# EAGLE design ATtiny10_v2 (EAGLE 8.3.0)
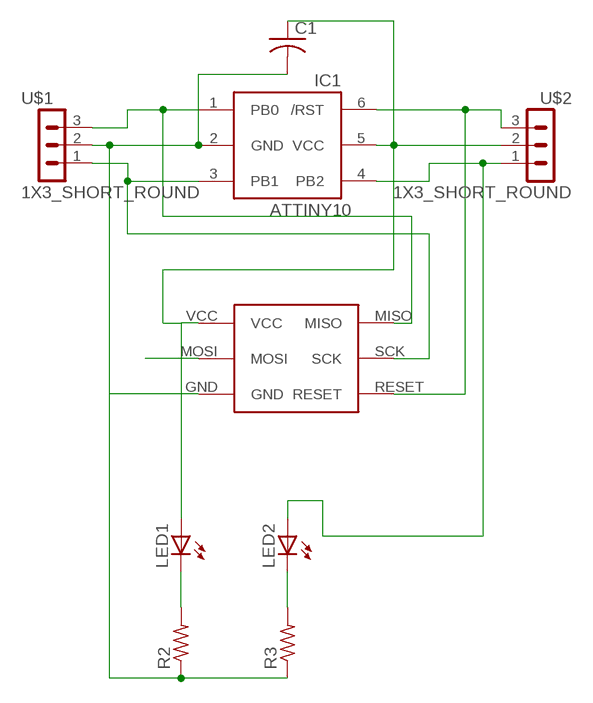
[diagram p0: schematic, sheet 1]

## Parts
C1  C-USC0402K  [C0402K]
IC1  ATTINY10  [SOT23-6]
LED1  LEDCHIPLED_0603  [CHIPLED_0603]
LED2  LEDCHIPLED_0603  [CHIPLED_0603]
R2  R-US_R0402  [R0402]
R3  R-US_R0402  [R0402]
U$1  1X3_SHORT_ROUND  [1X3_SHORT_ROUND]
U$2  1X3_SHORT_ROUND  [1X3_SHORT_ROUND]
U$4  TINY-AVR-POGO-PIN-KEY  [TINY-AVR-POGO-PIN-KEY]

## Nets
GND: C1.2 IC1.2(GND) R2.1 R3.1 U$1.2 U$4.GND
N$1: LED1.C R2.2
N$2: U$4.MOSI
N$3: LED2.C R3.2
PB0: IC1.1(PB0) U$1.3 U$4.MISO
PB1: IC1.3(PB1) U$1.1 U$4.SCK
PB2: IC1.4(PB2) LED2.A U$2.1
RST: IC1.6(/RST) U$2.3 U$4.RESET
VCC: C1.1 IC1.5(VCC) LED1.A U$2.2 U$4.VCC

## Library data of the parts
C1 = resistor:C-US: CAPACITOR, American symbol
IC1 = adafruit:ATTINY10: ATtiny4/5/9/10 8-bit Microcontroller with 512/1024 Bytes In-System Programmable Flash
LED1 LED2 = led:LED: LED OSRAM: - CHIPLED LG R971, LG N971, LY N971, LG Q971, LY Q971, LO R971, LY R971 LH N974, LH R974 LS Q976, LO Q976, LY Q976 LO Q996 - Hyper CHIPLED LW Q18S LB Q993, LB Q99A, LB R99A - SideLED LS A670, LO A670, LY A670, LG A670, LP A670 LB A673, LV A673, LT A673, LW A673 LH A674 LY A675 LS A676, LA A676, LO A676, LY A676, LW A676 LS A679, LY A679, LG A679 - Hyper Micro SIDELED® LS Y876, LA Y876, LO Y876, LY Y876 LT Y87S - SmartLED LW L88C, LW L88S LB L89C, LB L89S, LG L890 LS L89K, LO L89K, LY L89K LS L896, LA L896, LO L896, LY L896 - TOPLED LS T670, LO T670, LY T670, LG T670, LP T670 LSG T670, LSP T670, LSY T670, LOP T670, LYG T670 LG T671, LOG T671, LSG T671 LB T673, LV T673, LT T673, LW T673 LH T674 LS T676, LA T676, LO T676, LY T676, LB T676, LH T676, LSB T676, LW T676 LB T67C, LV T67C, LT T67C, LS T67K, LO T67K, LY T67K, LW E67C LS E67B, LA E67B, LO E67B, LY E67B, LB E67C, LV E67C, LT E67C LW T67C LS T679, LY T679, LG T679 LS T770, LO T770, LY T770, LG T770, LP T770 LB T773, LV T773, LT T773, LW T773 LH T774 LS E675, LA E675, LY E675, LS T675 LS T776, LA T776, LO T776, LY T776, LB T776 LHGB T686 LT T68C, LB T68C - Hyper Mini TOPLED® LB M676 - Mini TOPLED Santana® LG M470 LS M47K, LO M47K, LY M47K Source: http://www.osram.convergy.de LUXEON: - LUMILED® LXK2-PW12-R00, LXK2-PW12-S00, LXK2-PW14-U00, LXK2-PW14-V00 LXK2-PM12-R00, LXK2-PM12-S00, LXK2-PM14-U00 LXK2-PE12-Q00, LXK2-PE12-R00, LXK2-PE12-S00, LXK2-PE14-T00, LXK2-PE14-U00 LXK2-PB12-K00, LXK2-PB12-L00, LXK2-PB12-M00, LXK2-PB14-N00, LXK2-PB14-P00, LXK2-PB14-Q00 LXK2-PR12-L00, LXK2-PR12-M00, LXK2-PR14-Q00, LXK2-PR14-R00 LXK2-PD12-Q00, LXK2-PD12-R00, LXK2-PD12-S00 LXK2-PH12-R00, LXK2-PH12-S00 LXK2-PL12-P00, LXK2-PL12-Q00, LXK2-PL12-R00 Source: www.luxeon.com KINGBRIGHT: KA-3528ASYC Source: www.kingbright.com
R2 R3 = resistor:R-US_: RESISTOR, American symbol
U$1 U$2 = Random parts(01-14-14):1X3_SHORT_ROUND
U$4 = Ladvien_Eagle_Parts:TINY-AVR-POGO-PIN-KEY

## Board
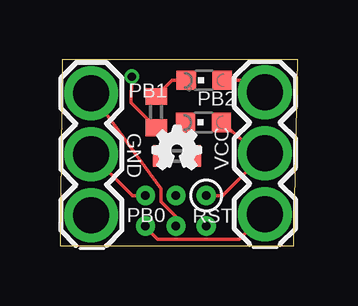
[diagram p1: board, top side]
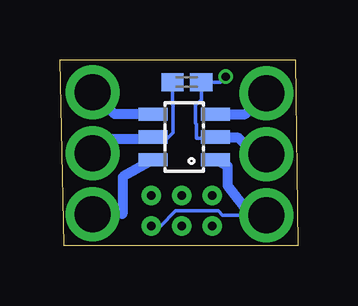
[diagram p2: board, bottom side, seen from below]

Size 9.92 x 7.73 mm. Coordinates in mm from the lower left corner, seen from the top.
Outline: 0,0 9.75,0 9.92,7.73 0.09,7.73 0,0
Copper layers (1*16): Top 0.035559375mm / dielectric 1.6mm / Bottom 0.035559375mm
Design rules "oshpark-2layer": minimum track width 6mil, minimum drill 10mil, track to track 6mil, track to pad 6mil, pad to pad 6mil, via to via 6mil, smd to smd 6mil, copper to edge 15mil, drill to drill 6mil, minimum pad ring 5mil, minimum via ring 5mil, stop-mask expansion 2.5mil, vias tented up to drill 0mil, thermal gap 10mil

### Footprints (pad centres in the part's own frame; a part is rotated, then mirrored left to right if it is on the bottom)
C0402K = smd 0.925 x 0.74: 1 -0.6,0; 2 0.6,0
SOT23-6 = smd 0.55 x 1.2: 1 -0.95,-1.3; 2 0,-1.3; 3 0.95,-1.3; 4 0.95,1.3; 5 0,1.3; 6 -0.95,1.3
CHIPLED_0603 = smd 0.8 x 0.8: A 0,-0.75; C 0,0.75
R0402 = smd 0.7 x 0.9: 1 -0.65,0; 2 0.65,0
1X3_SHORT_ROUND = drill 1.5 pad 2.2: 1 1.27,-1.52; 2 3.81,-1.52; 3 6.35,-1.52
TINY-AVR-POGO-PIN-KEY = drill 0.35 pad 0.8: GND 0,1.27; MISO 2.54,0; MOSI 1.27,1.27; RESET 0,0; SCK 1.27,0; VCC 2.54,1.27

### Placement (x,y rotation side)
C1  4.62,6.81 0 bottom
IC1  4.73,4.52 90 bottom
LED1  5.99,5.13 90 top
LED2  6.02,6.88 90 top
R2  4.88,3.73 0 top
R3  4.01,5.56 90 top
U$1  2.83,7.62 270 top
U$2  10.07,7.66 270 top
U$3  [OSHW_FILLX70_NOTEXT]  3.89,3.2 0 top
U$4  3.57,0.81 0 top

### Tracks (layer width: path | path; a pad name or v marks a point on that pad's centre or on a via)
GND  (via drill 0.35)
  Top 0.152: U$4.GND 3.04,2.08 U$1.2 | R2.1 4.23,4.7 | 4.23,4.7 R3.1 | 4.23,4.7 2.97,5.94 v3,7.04
  Bottom 0.152: IC1.2 3.48,4.47 4.22,4.47 4.22,5.06 4.26,5.1 4.26,5.84 4.02,6.08 C1.2 3.23,6.81 v3,7.04
  Bottom 0.406: U$1.2 1.79,3.81 2.47,4.49 3.4,4.49 IC1.2
N$1
  Top 0.152: LED1.C 5.24,4.02 R2.2
N$3
  Top 0.152: LED2.C 4.68,6.88 R3.2
PB0
  Bottom 0.152: U$4.MISO 5.73,0.81 5.1,1.44 3.31,1.44 3.13,1.27 1.5,1.27
  Bottom 0.406: U$1.3 1.5,1.27 1.94,1.27 2.91,2.5 2.91,3.31 IC1.1
PB1
  Top 0.152: U$4.SCK 4.84,1.2 4.21,1.82 4.21,2.36 U$1.1
  Bottom 0.406: IC1.3 2.19,5.47 U$1.1
PB2
  Top 0.152: LED2.A 8.06,6.88 U$2.1
  Bottom 0.406: IC1.4 7.63,5.47 U$2.1
RST
  Top 0.152: U$4.RESET 3.57,0.75 4.06,0.25 7.49,0.25 U$2.3
  Bottom 0.406: IC1.6 7.3,2.86 7.31,1.32 8.54,1.32 U$2.3
VCC
  Top 0.152: U$4.VCC 6.78,2.08 U$2.2 8.2,3.9 LED1.A
  Bottom 0.152: C1.1 5.22,5.86 5.2,5.84 5.2,4.71 5.44,4.47 5.98,4.47 IC1.5
  Bottom 0.406: U$2.2 8.34,3.85 7.76,4.44 6.11,4.44 IC1.5

### Text on the board
_tsilk: PB1 | PB2 | GND | VCC | PB0 | RST